# Altium schematic sheet v1.0.SchDoc
size 127 x 63 mm; PageSetup: Record=PageOptions|CenterHorizontal=True|CenterVertical=True|PrintScale=0.71|XCorrection=1.00|YCorrection=1.00|PrintKind=1|BorderSize=5000000|LeftOffset=0|BottomOffset=0|Orientation=2|PaperLength=1000|PaperWidth=1000|Scale=100|PaperSource=15|PrintQuality=4000|MediaType=1|DitherType=10|PrintScaleMode=1|PaperKind=A4|PaperIndex=9
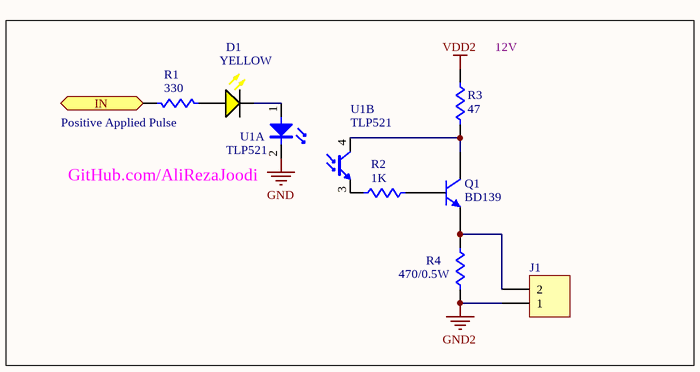
[diagram p0: v1.0.SchDoc]

## Parts
D1  YELLOW  [LED_THD_3MM_YELLOW_R]
J1  2Pin  [Fonics_2PIN_1]  (value not drawn)
Q1  BD139  [TO-226-AA]
R1  330  [0805]
R2  1K  [RESC3216N]
R3  47  [RESC3216N]
R4  470/0.5W  [RESC3216N]
U1  TLP521  [SMD_4PIN]  (parts A,B of 2)

## Ports
IN (in)

## Nets
GND: U1.2(K)
GND2: J1.1 R4.2
VDD2: R3.1
IN: R1.1 ; port IN
NetD1_1: D1.1(A) R1.2
NetD1_2: D1.2(K) U1.1(A)
NetJ1_2: J1.2 Q1.3(E) R4.1
NetQ1_1: Q1.1(C) R3.2 U1.4(C)
NetQ1_2: Q1.2(B) R2.2
NetR2_1: R2.1 U1.3(E)

## Notes on the sheet
- (near R3) 12V
- (near R1) Positive Applied Pulse
- (near U1) GitHub.com/AliRezaJoodi

## Library data of the parts
D1 = LED_YELLOW: LED, Yellow; Manufacturer: Generic Components; Class I: Optoelectronic; Published: 8-Jun-2000; Revision: July-2002: Re-released for DXP Platform.; Publisher: Altium Limited; Class II: LED
J1 = Header 2: Header, 2-Pin; LatestRevisionDate: 17-Jul-2002; LatestRevisionNote: Re-released for DXP Platform.; Publisher: Altium Limited
Q1 = NPN: NPN Bipolar Transistor; Published: 8-Jun-2000; LatestRevisionDate: 17-Jul-2002; LatestRevisionNote: Re-released for DXP Platform.; PackageReference: TO-226-AA; Publisher: Altium Limited; PackageDescription: TO, Flat Index; 3 In-Line, Axial Leads; Body Dia. 4.8mm; Leads 0.55 x 0.51 mm (max); Code_JEDEC: TO-226-AA
R1-R4 = Res1: Resistor; Manufacturer: Generic Components; Class I: Passive; Published: 8-Jun-2000; Revision: July-2002: Re-released for DXP Platform.; Publisher: Altium Limited; Class II: Resistor
U1 = Optoisolator: Publisher: Altium Limited